# Altium schematic sheet Preamp.SchDoc: =MainTitle
size 420 x 297 mm; SheetNumber: 2; SheetTotal: 9; EDA_Number: ARTIQ; Projet: ARTIQ/SINARA; ModifiedBy: -; CreateDate: XX/XX/XXXX; CheckedDate: -; Title2: Preamplifier; DivGrp: ISE; Designer: shanasz
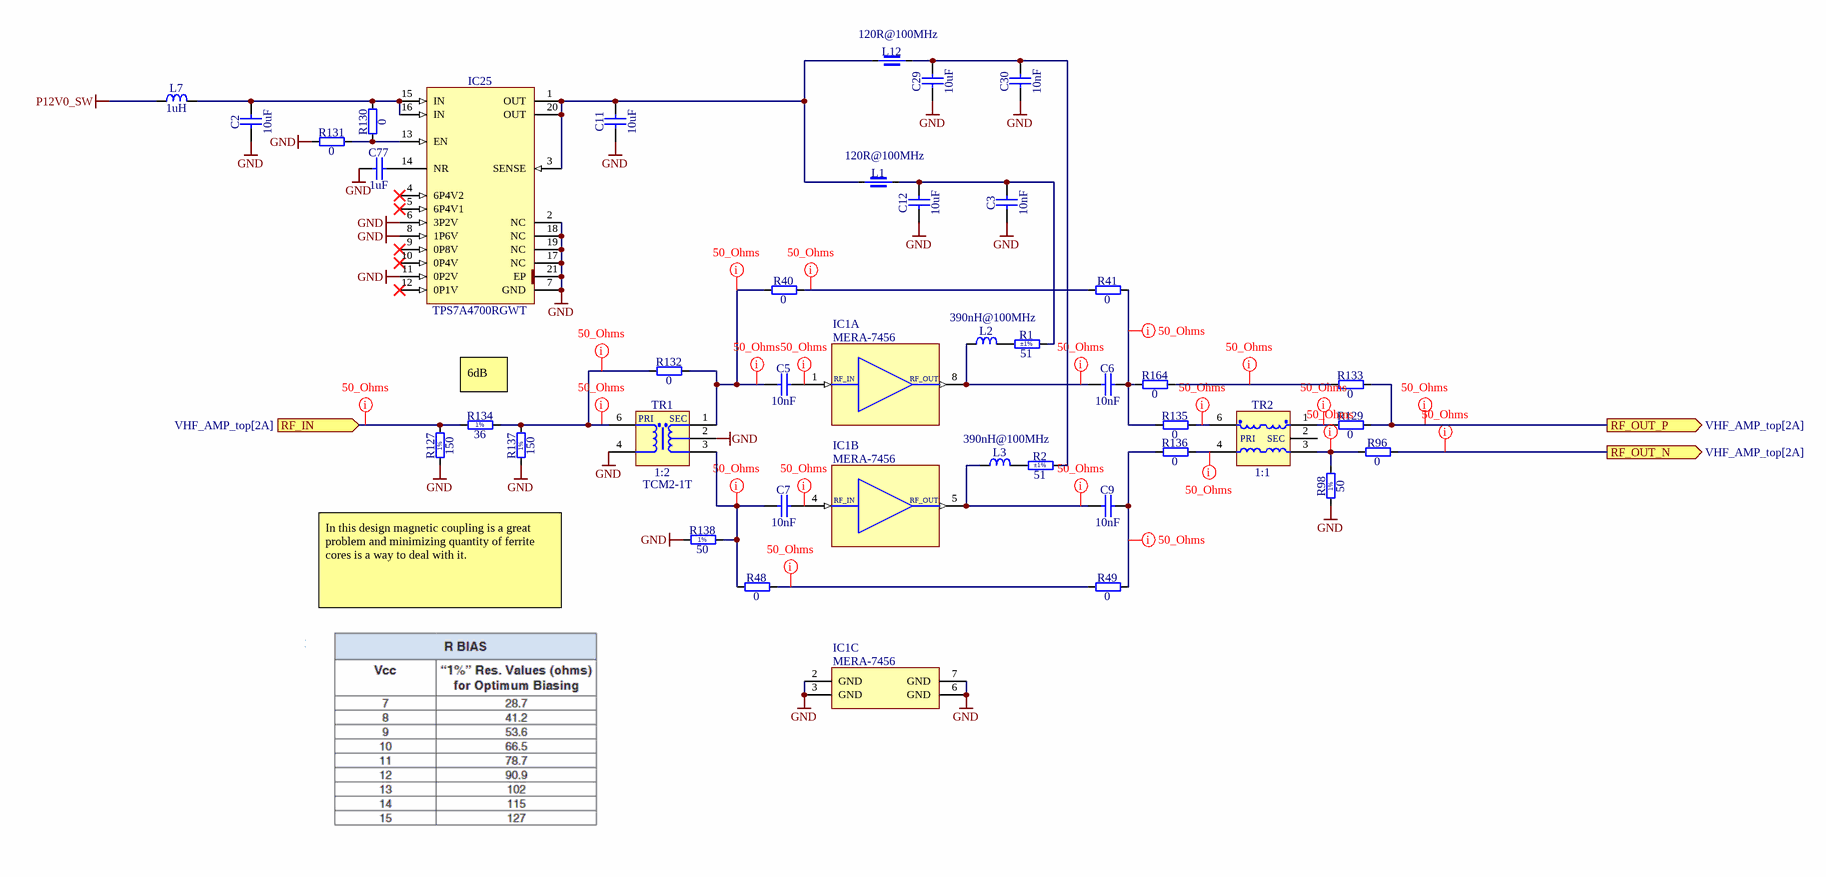
[diagram p0: Preamp.SchDoc]

## Parts
C2  10uF  [CAPC3216X140N]
C3  10nF  [CAPC1005X55N]
C5  10nF  [CAPC1608X87N]
C6  10nF  [CAPC1608X87N]
C7  10nF  [CAPC1608X87N]
C9  10nF  [CAPC1608X87N]
C11  10uF  [CAPC3216X140N]
C12  10uF  [CAPC3216X140N]
C29  10uF  [CAPC3216X140N]
C30  10nF  [CAPC1005X55N]
C77  1uF  [CAPC1608X87N]
IC1  MERA-7456  [MINI-CIRCUITS_DL1020]  (parts A,B,C of 3)
IC25  TPS7A4700RGWT  [QFN65P500X500X100-21N-S325]
L1  120R@100MHz  [INDC1005X55N]
L2  390nH@100MHz  [IND_COILCRAFT_0805HP]
L3  390nH@100MHz  [IND_COILCRAFT_0805HP]
L7  1uH  [INDC2620X100N]
L12  120R@100MHz  [INDC1005X55N]
R1  51  Tolerance: ±1%  [RESC5025X70N]
R2  51  Tolerance: ±1%  [RESC5025X70N]
R40  0  [RESC1608X55N]
R41  0  [RESC1608X55N]
R48  0  [RESC1608X55N]
R49  0  [RESC1608X55N]
R96  0  [RESC1608X55N]
R98  50  [RESC1608X55N]
R127  150  [RESC1608X55N]
R129  0  [RESC1608X55N]
R130  0  [RESC1608X55N]
R131  0  [RESC1608X55N]
R132  0  [RESC1608X55N]
R133  0  [RESC1608X55N]
R134  36  [RESC1608X55N]
R135  0  [RESC1608X55N]
R136  0  [RESC1608X55N]
R137  150  [RESC1608X55N]
R138  50  [RESC1608X55N]
R164  0  [RESC1608X55N]
TR1  1:2  Manufacturer Part Number: TCM2-1T  [XFMR_MINI-CIRCUITS_DB714]
TR2  1:1  [XFMR_MINI-CIRCUITS_AT224]

## Ports
RF_IN (in, see VHF_AMP_top[2A]), RF_OUT_N (out, see VHF_AMP_top[2A]), RF_OUT_P (out, see VHF_AMP_top[2A])

## Nets
GND: C2.1 C3.1 C11.1 C12.1 C29.1 C30.1 C77.1 IC1.2(GND) IC1.3(GND) IC1.6(GND) IC1.7(GND) IC25.2(NC) IC25.6(3P2V) IC25.7(GND) IC25.8(1P6V) IC25.11(0P2V) IC25.17(NC) IC25.18(NC) IC25.19(NC) IC25.21(EP) R98.1 R127.1 R131.1 R137.1 R138.1 TR1.2(NU) TR1.4(P)
P12V0_SW: L7.1
RF_IN: R127.2 R134.1 ; port RF_IN
RF_OUT_N: R96.2 ; port RF_OUT_N
RF_OUT_P: R129.2 R133.2 ; port RF_OUT_P
NetC2_2: C2.2 IC25.15(IN) IC25.16(IN) L7.2 R130.2
NetC3_2: C3.2 C12.2 L1.2 R1.2
NetC5_1: C5.1 R40.1 R132.2 TR1.1(SDOT)
NetC5_2: C5.2 IC1.1(RF-IN,_A1)
NetC6_1: C6.1 IC1.8(RF-OUT_and_DC-IN,_A1) L2.1
NetC6_2: C6.2 R41.2 R135.1 R164.1
NetC7_1: C7.1 R48.1 R138.2 TR1.3(S)
NetC7_2: C7.2 IC1.4(RF_IN,_A2)
NetC9_1: C9.1 IC1.5(RF-OUT_and_DC-IN,_A2) L3.1
NetC9_2: C9.2 R49.2 R136.1
NetC11_2: C11.2 IC25.1(OUT) IC25.3(SENSE) IC25.20(OUT) L1.1 L12.1
NetC29_2: C29.2 C30.2 L12.2 R2.2
NetC77_2: C77.2 IC25.14(NR)
NetIC25_13: IC25.13(EN) R130.1 R131.2
NetL2_2: L2.2 R1.1
NetL3_2: L3.2 R2.1
NetR40_2: R40.2 R41.1
NetR48_2: R48.2 R49.1
NetR96_1: R96.1 R98.2 TR2.3(S)
NetR129_1: R129.1 TR2.1(SDOT)
NetR132_1: R132.1 R134.2 R137.2 TR1.6(PDOT)
NetR133_1: R133.1 R164.2
NetR135_2: R135.2 TR2.6(PDOT)
NetR136_2: R136.2 TR2.4(P)

Not connected (* = marked no-connect by the designer): IC25 4(6P4V2)* 5(6P4V1)* 9(0P8V)* 10(0P4V)* 12(0P1V)*; TR2 2(NC)

## Layout directives
net class 50_Ohms: NetC5_1, NetC5_2, NetC6_1, NetC6_2, NetC7_1, NetC7_2, NetC9_1, NetC9_2, NetR40_2, NetR48_2, NetR96_1, NetR129_1, NetR132_1, NetR133_1, NetR135_2, NetR136_2, RF_IN, RF_OUT_N, RF_OUT_P

## Notes on the sheet
- 6dB
- In this design magnetic coupling is a great problem and minimizing quantity of ferrite cores is a way to deal with it.
- Project/Equipment
- Document
- Designer
- Drawn by
- Check.by
- Copyright WUT 2017
  This documentation describes Open Hardware and is licensed under the CERN OHL v.1.1. You may redistribute and modify this documentation under the terms of the CERN OHL v.1.1. (http://ohwr.org/CERNOHL). This documentation is distributed WITHOUT ANY EXPRESS OR IMPLIED WARRANTY, INCLUDING OF MERCHANTABILITY, SATISFACTORY QUALITY AND FITNESS FOR A PARTICULAR PURPOSE. Please see the CERN OHL v.1.1 for applicable conditions.
- File
- Last Mod.
- Print Date
- Sheet
- Size
- A3
- of
- Rev
- (in symbol MERA-7456, part A) RF_IN; RF_OUT
- (in symbol MERA-7456, part B) RF_IN; RF_OUT
- (in symbol R0603_36R_1%_0.1W_100PPM) 1%
- (in symbol R0603_50R_1%_0.1W_100PPM) 1%
- (in symbol R0603_150R_1%_0.1W_100PPM) 1%
- (in symbol XFMR_MINI-CIRCUITS_TC1-1-13M+) PRI; SEC
- (in symbol XFMR_MINI-CIRCUITS_TCM2-1T) PRI; SEC

## Library data of the parts
C2 C11 C12 C29 = CC1206_10UF_10V_10%_X7R: Non-polarised capacitor; Part Description: SMD Multilayer Chip Ceramic Capacitor; Manufacturer: GENERIC; Manufacturer1 Part Number: C1206C106K8RAC; Voltage: 10V; TC: X7R; Tolerance: ±10%; Part Number: CC1206_10UF_10V_10%_X7R; Component Kind: Standard; Component Type: Standard; Pin Count: 2; Value: 10uF; Status: Preferred; Manufacturer Part Number: CC1206_10UF_10V_10%_X7R; Case: 1206; Mounted: Yes; Socket: No; SMD: Yes; Sense: No; Manufacturer1 Example: KEMET; Manufacturer1 ComponentHeight: 1.8mm; HelpURL: \\cern.ch\dfs\Applications\Altium\Datasheets\CC1206_X7R_KEMET.pdf; Author: CERN DEM JLC; CreateDate: 03.12.2007; LatestRevisionDate: 03.12.2007
C3 C30 = CC0402_10NF_16V_10%_X7R: Non-polarised capacitor; Part Description: SMD Multilayer Chip Ceramic Capacitor; Manufacturer: GENERIC; Manufacturer1 Part Number: 223878715636; Voltage: 16V; TC: X7R; Tolerance: ±10%; Part Number: CC0402_10NF_16V_10%_X7R; Component Kind: Standard; Component Type: Standard; Pin Count: 2; Value: 10nF; Status: Not Recommended; Manufacturer Part Number: CC0402_10NF_16V_10%_X7R; Case: 0402; Mounted: Yes; Socket: No; SMD: Yes; Sense: No; Manufacturer1 Example: PHYCOMP; Manufacturer1 ComponentHeight: 0.55mm; HelpURL: \\cern.ch\dfs\Applications\Altium\Datasheets\CC0402_X7R_PHYCOMP.pdf; Author: CERN DEM JLC; CreateDate: 03.12.2007; LatestRevisionDate: 03.12.2007
C5-C7 C9 = CC0603_10NF_50V_10%_X7R: Non-polarised capacitor; Part Description: SMD Multilayer Chip Ceramic Capacitor; Manufacturer: GENERIC; Manufacturer1 Part Number: 223858615636; Voltage: 50V; TC: X7R; Tolerance: ±10%; Part Number: CC0603_10NF_50V_10%_X7R; Component Kind: Standard; Component Type: Standard; Pin Count: 2; Value: 10nF; Status: Preferred; Manufacturer Part Number: CC0603_10NF_50V_10%_X7R; Case: 0603; Mounted: Yes; Socket: No; SMD: Yes; Sense: No; Manufacturer1 Example: PHYCOMP; Manufacturer1 ComponentHeight: 0.87mm; HelpURL: \\cern.ch\dfs\Applications\Altium\Datasheets\CC0603_X7R_PHYCOMP.pdf; Author: CERN DEM JLC; CreateDate: 03.12.2007; LatestRevisionDate: 03.12.2007
C77 = CC0603_1UF_16V_10%_X7R: Non-polarised capacitor; Part Description: SMD Multilayer Chip Ceramic Capacitor; Manufacturer: GENERIC; Manufacturer1 Part Number: 223878615663; Voltage: 16V; TC: X7R; Tolerance: ±10%; Part Number: CC0603_1UF_16V_10%_X7R; Component Kind: Standard; Component Type: Standard; Pin Count: 2; Value: 1uF; Status: None; Manufacturer Part Number: CC0603_1UF_16V_10%_X7R; Case: 0603; Mounted: Yes; Socket: No; SMD: Yes; Sense: No; Manufacturer1 Example: YAGEO PHYCOMP; Manufacturer1 ComponentHeight: 0.9mm; HelpURL: \\cern.ch\dfs\Applications\Altium\Datasheets\CC0603_X7R_PHYCOMP.pdf; Author: CERN DEM JLC; CreateDate: 03.12.2007; LatestRevisionDate: 17.04.2015
IC1 = MERA-7456: Dual Differential Inputs and  Complementary TTL outputs; Part Description: DC-1GHz, Dual Matched MMIC Amplifier; Manufacturer: MINI-CIRCUITS; PressFit: No; Bonding: No; Part Number: MERA-7456; Component Kind: Standard; Component Type: Standard; Device: MERA-7456; PackageDescription: SON, 1.27mm Pitch; 8 Pin, 6mm W X 4.9mm L X 0.90mm H body (w/Thermal Tab 2.5 X 3.0mm), IPC Medium Density; Manufacturer Part Number: MERA-7456; Pin Count: 9; Case: SON8; Mounted: Yes; Socket: No; SMD: Yes; Sense: No; ComponentHeight: 0.90mm; Author: CERN DEM HF; HelpURL: \\cern.ch\dfs\Applications\Altium\Datasheets\MERA-7456.pdf; ComponentLink1URL: \\cern.ch\dfs\Applications\Altium\Datasheets\MINI-CIRCUITS_DL1020.pdf; ComponentLink1Description: Package Drawing; CreateDate: 31.05.2023; LatestRevisionDate: 31.05.2023
IC25 = TPS7A4700RGWT: Low Noise (3uVrms), 1A, High Voltage Low-Dropout Linear Regulator; Part Description: 1.4V to 19.1V, 1A, Low Noise (3.5uVrms), Low-Dropout Linear Regulator; Manufacturer: TEXAS INSTRUMENTS; PressFit: No; Bonding: No; Part Number: TPS7A4700RGWT; Component Kind: Standard; Component Type: Standard; Device: TPS7A4700RGWT; PackageDescription: QFN, 0.65mm Pitch, Square; 20 Pin, 5.00mm L X 5.00mm W X 1.00mm H body (w/Thermal Tab 3.25 X 3.25mm), IPC Medium Density; Manufacturer Part Number: TPS7A4700RGW; Pin Count: 21; Case: QFN20; Mounted: Yes; Socket: No; SMD: Yes; Sense: No; ComponentHeight: 1mm; HelpURL: \\cern.ch\dfs\Applications\Altium\Datasheets\TPS7A4700RGWT.pdf; Author: CERN DEM JLC; CreateDate: 03.07.2012; LatestRevisionDate: 13.06.2022
L1 L12 = IND0402_MURATA_BLM15PX121SN1D: Part Description: SMD EMIFIL Chip Ferrite Bead; Manufacturer: MURATA; Power: 2A; Resistance: 0.055R; Tolerance: ±25%; Part Number: IND0402_MURATA_BLM15PX121SN1D; Component Kind: Standard; Component Type: Standard; Pin Count: 2; Value: 120R@100MHz; Manufacturer Part Number: BLM15PX121SN1D; Case: 0402; Mounted: Yes; Socket: No; SMD: Yes; Sense: No; ComponentHeight: 0.55mm; HelpURL: \\cern.ch\dfs\Applications\Altium\Datasheets\IND0402_MURATA_BLM15PX.pdf; Author: CERN DEM JMW; CreateDate: 19.02.2014; LatestRevisionDate: 25.10.2018
L2 L3 = IND0805_COILCRAFT_0805HP-391XGR: Inductor; Part Description: Chip Inductor; Power: 330mA; Resistance: 1.11R; Tolerance: ±2%; Part Number: IND0805_COILCRAFT_0805HP-391XGR; Component Kind: Standard; Component Type: Standard; Pin Count: 2; Value: 390nH@100MHz; Manufacturer: COILCRAFT; Manufacturer Part Number: 0805HP-391XGR; Case: 0805; Mounted: Yes; Socket: No; SMD: Yes; Sense: No; ComponentHeight: 1.55mm; HelpURL: \\cern.ch\dfs\Applications\Altium\Datasheets\IND_COILCRAFT_0805HP.pdf; Author: CERN DEM JLC; CreateDate: 21.03.2018; LatestRevisionDate: 21.03.2018
L7 = IND1008_1UH_20%_WURTH_74479787210B: Inductor; Part Description: Power Multilayer Inductor (WE-PMI Series); Manufacturer: WURTH ELEKTRONIK; Power: 1.95A; Resistance: 0.06R; Tolerance: ±20%; Part Number: IND1008_1UH_20%_WURTH_74479787210B; Component Kind: Standard; Component Type: Standard; Pin Count: 2; Value: 1uH; Status: None; Manufacturer Part Number: 74479787210B; Mounted: Yes; Socket: No; SMD: Yes; Sense: No; ComponentHeight: 1mm; HelpURL: \\cern.ch\dfs\Applications\Altium\Datasheets\IND_WURTH_WE-PMI_74479787210B.pdf; Author: CERN DEM JLC; CreateDate: 01.10.2014; LatestRevisionDate: 01.10.2014; Case: 1008
R1 R2 = R2010_51R_1%_1W_100PPM_BOURNS_CRM: Resistor - 1%; Part Description: Power Thick Film Chip Resistor; Manufacturer: BOURNS; Manufacturer Part Number: CRM2010-FX-51R0ELF; Power: 1W; TC: ±100ppm/°C; PressFit: No; Part Number: R2010_51R_1%_1W_100PPM_BOURNS_CRM; Component Kind: Standard; Component Type: Standard; Pin Count: 2; Value: 51; Status: None; Case: 2010; Mounted: Yes; Sense: No; Socket: No; SMD: Yes; ComponentHeight: 0.7mm; HelpURL: \\cern.ch\dfs\Applications\Altium\Datasheets\R2010_BOURNS_CRM.pdf; Author: CERN DEM JLC; CreateDate: 01.12.2011; LatestRevisionDate: 18.12.2018
R40 R41 R48 R49 R96 R129-R133 R135 R136 R164 = R0603_0R_JUMPER: Resistor; Part Description: 1A (0.05R Max DC Resistance) Zero Ohm Jumper; Manufacturer: GENERIC; Manufacturer1 Part Number: NRC06Z0; PressFit: No; Part Number: R0603_0R_JUMPER; Component Kind: Standard; Component Type: Standard; Pin Count: 2; Value: 0; Status: Preferred; Manufacturer Part Number: R0603_0R_JUMPER; Case: 0603; Mounted: Yes; Sense: No; Socket: No; SMD: Yes; Manufacturer1 Example: NIC COMPONENT; Manufacturer1 ComponentHeight: 0.55mm; HelpURL: \\cern.ch\dfs\Applications\Altium\Datasheets\R0603_NIC_NRC.pdf; Author: CERN DEM JLC; CreateDate: 03.12.2007; LatestRevisionDate: 13.03.2008
R98 = R0603_50R_1%_0.1W_100PPM: Resistor - 1%; Part Description: General Purpose Thick Film Chip Resistor; Manufacturer: GENERIC; Manufacturer1 Part Number: CRCW060350R0FKEA; Power: 0.1W; TC: ±100ppm/°C; PressFit: No; Part Number: R0603_50R_1%_0.1W_100PPM; Component Kind: Standard; Component Type: Standard; Pin Count: 2; Value: 50; Status: Preferred; Tolerance: ±1%; Manufacturer Part Number: R0603_50R_1%_0.1W_100PPM; Case: 0603; Mounted: Yes; Sense: No; Socket: No; SMD: Yes; Manufacturer1 Example: VISHAY; Manufacturer1 ComponentHeight: 0.50mm; HelpURL: \\cern.ch\dfs\Applications\Altium\Datasheets\R0603_VISHAY_CRCW e3.pdf; Author: CERN DEM MR; CreateDate: 08.09.2017; LatestRevisionDate: 08.09.2017
R127 R137 = R0603_150R_1%_0.1W_100PPM: Resistor - 1%; Part Description: General Purpose Thick Film Chip Resistor; Manufacturer: GENERIC; Manufacturer1 Part Number: NRC06F1500TRF; Power: 0.1W; TC: ±100ppm/°C; PressFit: No; Part Number: R0603_150R_1%_0.1W_100PPM; Component Kind: Standard; Component Type: Standard; Pin Count: 2; Value: 150; Status: Preferred; Tolerance: ±1%; Manufacturer Part Number: R0603_150R_1%_0.1W_100PPM; Case: 0603; Mounted: Yes; Sense: No; Socket: No; SMD: Yes; Manufacturer1 Example: NIC COMPONENT; Manufacturer1 ComponentHeight: 0.55mm; HelpURL: \\cern.ch\dfs\Applications\Altium\Datasheets\R0603_NIC_NRC.pdf; Author: CERN DEM JLC; CreateDate: 03.12.2007; LatestRevisionDate: 13.03.2008
R134 = R0603_36R_1%_0.1W_100PPM: Resistor - 1%; Part Description: General Purpose Thick Film Chip Resistor; Manufacturer: GENERIC; Manufacturer1 Part Number: NRC06F36R0TRF; PressFit: No; Power: 0.1W; TC: ±100ppm/°C; Part Number: R0603_36R_1%_0.1W_100PPM; Component Kind: Standard; Component Type: Standard; Pin Count: 2; Value: 36; Status: Preferred; Manufacturer Part Number: R0603_36R_1%_0.1W_100PPM; Case: 0603; Mounted: Yes; Sense: No; Socket: No; SMD: Yes; Manufacturer1 Example: NIC COMPONENT; Manufacturer1 ComponentHeight: 0.55mm; HelpURL: \\cern.ch\dfs\Applications\Altium\Datasheets\R0603_NIC_NRC.pdf; Author: CERN DEM JLC; CreateDate: 03.12.2007; LatestRevisionDate: 13.03.2008; Tolerance: ±1%
R138 = R0603_50R_1%_0.1W_100PPM: Resistor - 1%; Part Description: General Purpose Thick Film Chip Resistor; Manufacturer: GENERIC; Manufacturer1 Part Number: CRCW060350R0FKEA; PressFit: No; Power: 0.1W; TC: ±100ppm/°C; Part Number: R0603_50R_1%_0.1W_100PPM; Component Kind: Standard; Component Type: Standard; Pin Count: 2; Value: 50; Status: Preferred; Manufacturer Part Number: R0603_50R_1%_0.1W_100PPM; Case: 0603; Mounted: Yes; Sense: No; Socket: No; SMD: Yes; Manufacturer1 Example: VISHAY; Manufacturer1 ComponentHeight: 0.50mm; HelpURL: \\cern.ch\dfs\Applications\Altium\Datasheets\R0603_VISHAY_CRCW e3.pdf; Author: CERN DEM MR; CreateDate: 08.09.2017; LatestRevisionDate: 08.09.2017; Tolerance: ±1%
TR1 = XFMR_MINI-CIRCUITS_TCM2-1T: 50 Ohms 3 to 300MHz RF Transformer; Power: 0.25W; Part Number: XFMR_MINI-CIRCUITS_TCM2-1T; Component Kind: Standard; Component Type: Standard; Pin Count: 6; Value: 1:2; Status: None; Part Description: 50 Ohms 3 to 300MHz RF Transformer; Manufacturer: MINI-CIRCUITS; Mounted: Yes; Socket: No; Sense: No; SMD: Yes; ComponentHeight: 4.06mm; HelpURL: \\cern.ch\dfs\Applications\Altium\Datasheets\XFMR_MINI-CIRCUITS_TCM2-1T.pdf; Author: CERN DEM HF; CreateDate: 30.05.2023; LatestRevisionDate: 30.05.2023
TR2 = XFMR_MINI-CIRCUITS_TC1-1-13M+: 50 Ohms 4.5 To 3000MHz RF Transformers; Part Number: XFMR_MINI-CIRCUITS_TC1-1-13M+; Component Kind: Standard; Component Type: Standard; Pin Count: 5; Value: 1:1; Status: None; Part Description: 50 Ohms 4.5 to 3000MHz RF Transformer; Manufacturer: MINI-CIRCUITS; Manufacturer Part Number: TC1-1-13M+; Mounted: Yes; Socket: No; Sense: No; SMD: Yes; ComponentHeight: 3.81mm; HelpURL: \\cern.ch\dfs\Applications\Altium\Datasheets\XFMR_MINI-CIRCUITS_TC1-1-13M+.pdf; Author: CERN DEM JLC; CreateDate: 30.11.2011; LatestRevisionDate: 30.11.2011